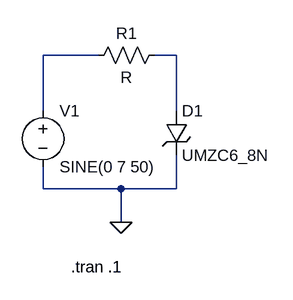
[diagram p0: schematic Draft1.asc]
Draft1.asc, the LTspice schematic file:
Version 4
SHEET 1 880 680
WIRE 96 16 16 16
WIRE 208 16 176 16
WIRE 16 96 16 16
WIRE 208 96 208 16
WIRE 16 208 16 176
WIRE 128 208 16 208
WIRE 208 208 208 160
WIRE 208 208 128 208
WIRE 128 256 128 208
FLAG 128 256 0
SYMBOL zener 192 96 R0
SYMATTR InstName D1
SYMATTR Value UMZC6_8N
SYMBOL voltage 16 80 R0
WINDOW 123 0 0 Left 0
WINDOW 39 0 0 Left 0
SYMATTR InstName V1
SYMATTR Value SINE(0 7 50)
SYMBOL res 192 0 R90
WINDOW 0 0 56 VBottom 2
WINDOW 3 32 56 VTop 2
SYMATTR InstName R1
TEXT 56 320 Left 2 !.tran .1

The netlist it stands for:
* Draft1.asc
D1 N002 0 UMZC6_8N
V1 N001 0 SINE(0 7 50)
R1 N002 N001 R
.model D D
.lib standard.dio
.tran .1
.backanno
.end